# Altium project MainBoard.PrjPcb
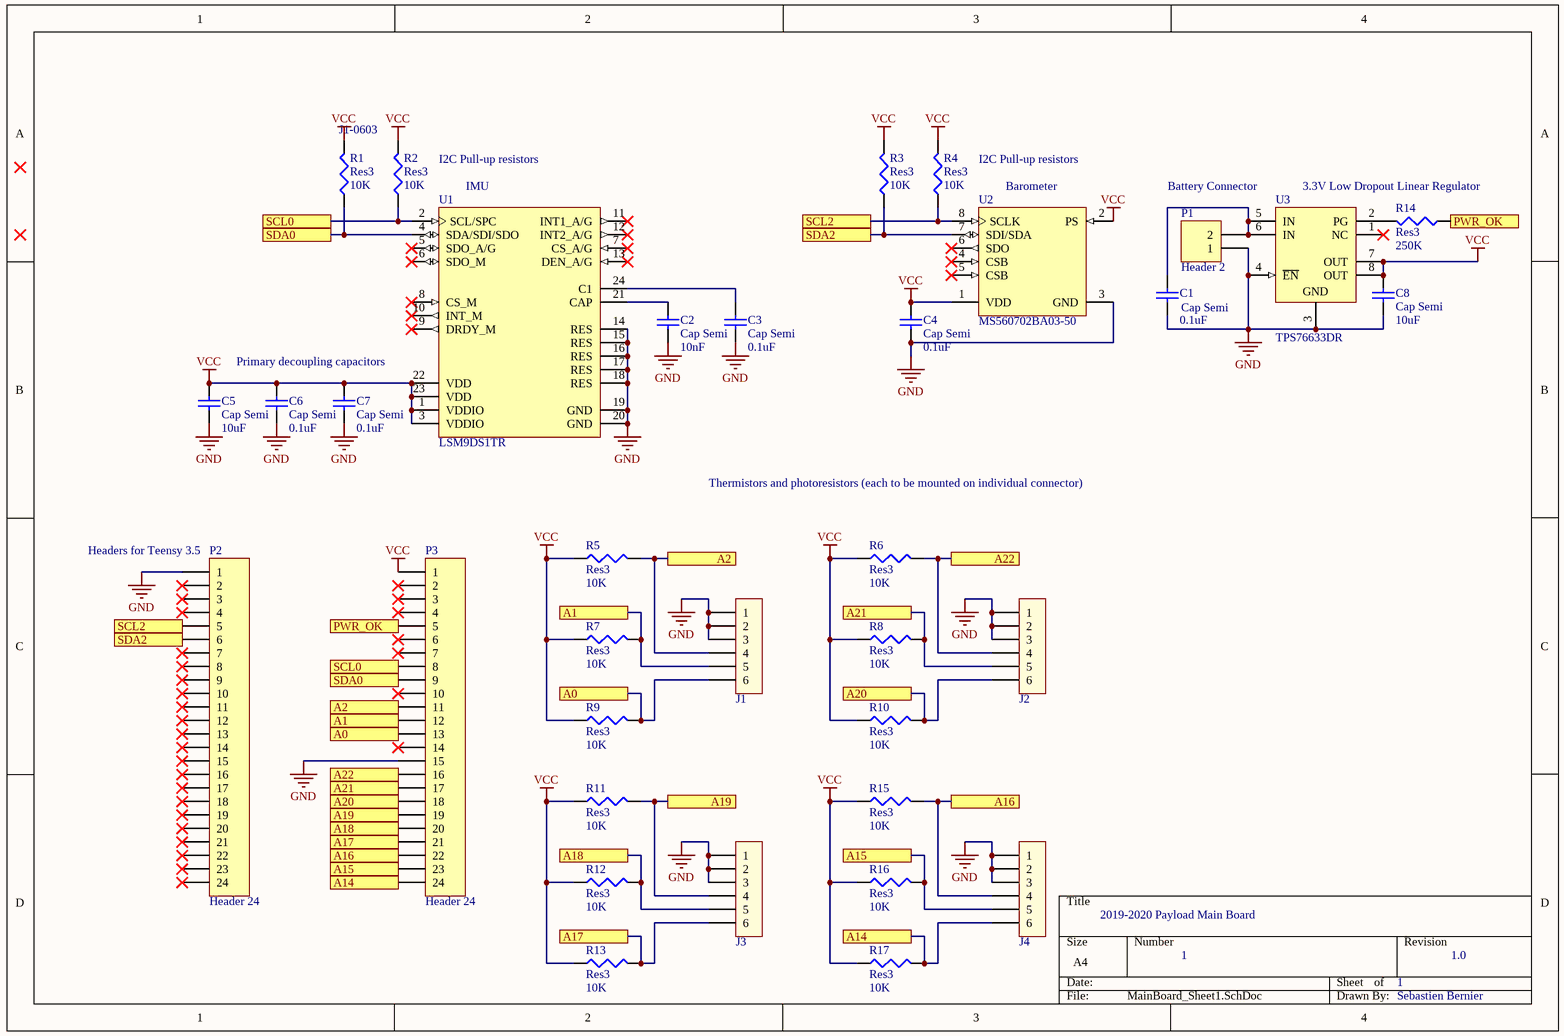
[diagram p0: MainBoard_Sheet1.SchDoc]
1 sheet, 35 parts. Net scope: flat (ports and power ports of the same name join across sheets).
Board files: MainBoard_PCB1.PcbDoc, MainBoard_PCB2.PcbDoc, MainBoard_Gerber1.PcbDoc

## Sheet MainBoard_Sheet1.SchDoc
size A4

### Parts
C1  Cap Semi  value 0.1uF  [C1206]
C2  Cap Semi  value 10nF  [C1206]
C3  Cap Semi  value 0.1uF  [C1206]
C4  Cap Semi  value 0.1uF  [C1206]
C5  Cap Semi  value 10uF  [C1206]
C6  Cap Semi  value 0.1uF  [C1206]
C7  Cap Semi  value 0.1uF  [C1206]
C8  Cap Semi  value 10uF  [C1206]
J1  0430450600  [0430450600]  (value not drawn)
J2  0430450600  [0430450600]  (value not drawn)
J3  0430450600  [0430450600]  (value not drawn)
J4  0430450600  [0430450600]  (value not drawn)
P1  Header 2  [HDR1X2]
P2  Header 24  [HDR1X24]
P3  Header 24  [HDR1X24]
R1  Res3  value 10K  [J1-0603]
R2  Res3  value 10K  [J1-0603]
R3  Res3  value 10K  [J1-0603]
R4  Res3  value 10K  [J1-0603]
R5  Res3  value 10K  [J1-0603]
R6  Res3  value 10K  [J1-0603]
R7  Res3  value 10K  [J1-0603]
R8  Res3  value 10K  [J1-0603]
R9  Res3  value 10K  [J1-0603]
R10  Res3  value 10K  [J1-0603]
R11  Res3  value 10K  [J1-0603]
R12  Res3  value 10K  [J1-0603]
R13  Res3  value 10K  [J1-0603]
R14  Res3  value 250K  [J1-0603]
R15  Res3  value 10K  [J1-0603]
R16  Res3  value 10K  [J1-0603]
R17  Res3  value 10K  [J1-0603]
U1  LSM9DS1TR  [STM-LGA-24_3500X3000X1000]
U2  MS560702BA03-50  [TECO-MS560702BA03-50_V]
U3  TPS76633DR  [D0008A_N]

### Ports
A0, A1, A2, A14, A15, A16, A17, A18, A19, A20, A21, A22, PWR_OK, SCL0, SCL2, SDA0, SDA2

### Nets
GND: C1.1 C2.1 C3.1 C4.1 C5.1 C6.1 C7.1 C8.1 J1.1 J1.2 J1.3 J2.1 J2.2 J2.3 J3.1 J3.2 J3.3 J4.1 J4.2 J4.3 P1.1 P2.1 P3.15 U1.14(RES) U1.15(RES) U1.16(RES) U1.17(RES) U1.18(RES) U1.19(GND) U1.20(GND) U2.3(GND) U3.3(GND) U3.4(~{EN})
VCC: C4.2 C5.2 C6.2 C7.2 C8.2 P3.1 R1.2 R2.2 R3.2 R4.2 R5.1 R6.1 R7.1 R8.1 R9.1 R10.1 R11.1 R12.1 R13.1 R15.1 R16.1 R17.1 U1.1(VDDIO) U1.3(VDDIO) U1.22(VDD) U1.23(VDD) U2.1(VDD) U2.2(PS) U3.7(OUT) U3.8(OUT)
A0: J1.6 P3.13 R9.2 ; port A0
A1: J1.5 P3.12 R7.2 ; port A1
A2: J1.4 P3.11 R5.2 ; port A2
A14: J4.6 P3.24 R17.2 ; port A14
A15: J4.5 P3.23 R16.2 ; port A15
A16: J4.4 P3.22 R15.2 ; port A16
A17: J3.6 P3.21 R13.2 ; port A17
A18: J3.5 P3.20 R12.2 ; port A18
A19: J3.4 P3.19 R11.2 ; port A19
A20: J2.6 P3.18 R10.2 ; port A20
A21: J2.5 P3.17 R8.2 ; port A21
A22: J2.4 P3.16 R6.2 ; port A22
PWR_OK: P3.5 R14.1 ; port PWR_OK
SCL0: P3.8 R2.1 U1.2(SCL/SPC) ; port SCL0
SCL2: P2.5 R4.1 U2.8(SCLK) ; port SCL2
SDA0: P3.9 R1.1 U1.4(SDA/SDI/SDO) ; port SDA0
SDA2: P2.6 R3.1 U2.7(SDI/SDA) ; port SDA2
NetC1_2: C1.2 P1.2 U3.5(IN) U3.6(IN)
NetC2_2: C2.2 U1.21(CAP)
NetC3_2: C3.2 U1.24(C1)
NetR14_2: R14.2 U3.2(PG)

Not connected (* = marked no-connect by the designer): P2 2* 3* 4* 7* 8* 9* 10* 11* 12* 13* 14* 15* 16* 17* 18* 19* 20* 21* 22* 23* 24*; P3 2* 3* 4* 6* 7* 10* 14*; U1 5(SDO_A/G)* 6(SDO_M)* 7(CS_A/G)* 8(CS_M)* 9(DRDY_M)* 10(INT_M)* 11(INT1_A/G)* 12(INT2_A/G)* 13(DEN_A/G)*; U2 4(CSB)* 5(CSB)* 6(SDO)*; U3 1(NC)*

### Notes on the sheet
- I2C Pull-up resistors
- (near U1) IMU
- (near U2) Barometer
- Battery Connector
- 3.3V Low Dropout Linear Regulator
- Primary decoupling capacitors
- Thermistors and photoresistors (each to be mounted on individual connector)
- (near P2) Headers for Teensy 3.5
- 2019-2020 Payload Main Board
- 1
- 1.0
- Sebastien Bernier

### Library data of the parts
C1-C8 = Cap Semi: Capacitor (Semiconductor SIM Model); Published: 8-Jun-2000; LatestRevisionDate: 29-May-2009; LatestRevisionNote: IPC-7351 Footprint Added.; PackageReference: C1206; Publisher: Altium Limited; PackageDescription: Chip Capacitor
J1-J4 = 0430450600: CONN HEADER R/A 6POS 3MM; Manufacturer: Molex; Number of Positions: 6; Row Spacing - Mating: 0.118" (3.00mm); Shrouding: Shrouded - 4 Wall; Contact Length - Post: 0.125" (3.18mm); Material Flammability Rating: UL94 V-0; Current Rating (Amps): 8A; Voltage Rating: 600V; ComponentLink1Description: Drawing; ComponentLink1URL: https://www.molex.com/pdm_docs/sd/430450600_sd.pdf; ComponentLink2Description: Product Specification; ComponentLink2URL: https://www.molex.com/pdm_docs/ps/PS-43045.pdf; Manufacturer Part Number: 0430450600; Contact Type: Male Pin; Number of Rows: 2; Mounting Type: Through Hole, Right Angle; Termination: Solder; Fastening Type: Locking Ramp; Insulation Height: 0.290" (7.37mm); Contact Shape: Square; Contact Finish - Mating: Tin; Contact Finish Thickness - Mating: 100.0µin (2.54µm); Contact Finish - Post: Tin; Contact Material: Brass; Insulation Material: Liquid Crystal Polymer (LCP), Glass Filled; Features: Board Lock; Insulation Color: Black; Supplier 1: Digi-Key; Supplier Part Number 1: WM1815-ND
P1 = Header 2: Header, 2-Pin; LatestRevisionDate: 17-Jul-2002; LatestRevisionNote: Re-released for DXP Platform.; Publisher: Altium Limited
P2 P3 = Header 24: Header, 24-Pin; LatestRevisionDate: 17-Jul-2002; LatestRevisionNote: Re-released for DXP Platform.; Publisher: Altium Limited
R1-R17 = Res3: Resistor; Published: 8-Jun-2000; LatestRevisionDate: 29-May-2009; LatestRevisionNote: IPC-7351 Footprint Added.; PackageReference: J1-0603; Publisher: Altium Limited; PackageDescription: Chip Resistor
U1 = CMP-2000-06606-1: iNEMO Inertial Module: 3D Accelerometer, 3D Gyroscope, 3D Magnetometer, 1.9 to 3.6 V, -40 to 85 degC, 24-Pin LGA, RoHS, Tape and Reel; Manufacturer: STMicroelectronics; SVHC: NoSVHC(17-Dec-2015); MEMS Module Function: Tri-AxisGyroscope,Tri-AxisAccelerometer,Tri-AxisMagnetometer; Supply Voltage Max: 3.6V; No. of Pins: 24Pins; Gyroscope Range: ±245°/s,±500°/s,±2000°/s; Acceleration Range: ±2g,±4g,±8g,±16g; Supply Voltage Min: 1.9V; Package Description: 24-Pin Plastic Land Grid Array Package, Body 3.65 x 3.15 mm, Pitch 0.43 mm; Manufacturer URL: http://www.st.com/; PartNumber: LSM9DS1; Product Range: -; Packaging: CutTape; Sensor Case Style: LGA; Datasheet URL: http://www2.st.com/content/ccc/resource/technical/document/datasheet/1e/3f/2a/d6/25/eb/48/46/DM00103319.pdf/files/DM00103319.pdf/jcr:content/translations/en.DM00103319.pdf; Package Reference: LGA-24_3500X3000X1000; Mounting Technology: SurfaceMount; Datasheet Version: Rev. 3, 03/2015; MSL: MSL3-168hours
U2 = CMP-2000-07512-1: Barometric Pressure Sensor, with Stainless Steel Cap , 1.8 to 3.6 V, -40 to 85 degC, 8-Pin SMD, RoHS, Tape and Reel; Manufacturer: TE Connectivity; Lead Free: LeadFree; RoHSCompliant: false; Mounting Technology: SurfaceMount; Datasheet URL: http://www.te.com/commerce/DocumentDelivery/DDEController?Action=showdoc&DocId=Data+Sheet%7FMS5607-02BA03%7FB2%7Fpdf%7FEnglish%7FENG_DS_MS5607-02BA03_B2.pdf%7FMS560702BA03-50; Manufacturer URL: http://www.te.com/; Package Description: 8-Pin Surface Mount Device, Body 3 x 5 mm, Pitch 1.25 mm; Package Reference: MS560702BA03-50; Datasheet Version: 06/2017
U3 = CMP-0394-00013-2: Single Output LDO, 250 mA, Fixed 3.3 V Output, 2.7 to 10 V Input, with Low IQ, 8-pin SOIC (D), -40 to 125 degC, Green (RoHS & no Sb/Br); Manufacturer: Texas Instruments; Power Good: TRUE; Vdo(Typ)(mV): 230; Fixed Output Options(V): 3.3; Iout(Max)(A): 0.25; Iq(Typ)(mA): 0.03; Vin(Max)(V): 10; SubFamily: Single Channel LDO; Vin(Min)(V): 2.7; Code_JEDEC: MS-012; ComponentLink1Description: Manufacturer URL; ComponentLink2URL: http://www.ti.com/general/docs/lit/getliterature.tsp?genericPartNumber=TPS76633&fileType=pdf; Mounting Technology: Surface Mount; ComponentLink1URL: http://www.ti.com/; PackageVersion: 4040047-3/M; ComponentLink3Description: Package Specification; DatasheetVersion: SLVS237C; Vout Adj(Max)(V): 3.3; ComponentLink2Description: Datasheet; PackageReference: D0008A; ComponentLink3URL: http://www.ti.com/litv/pdf/msoi002j; Vout Adj(Min)(V): 3.3; PartNumber: TPS76633DR; Eco-Plan: Green (RoHS & no Sb/Br); PackageDescription: 8-Pin Plastic Small Outline, Body 4.9 x 3.9 mm, Pitch 1.27 mm